# Altium schematic sheet OV2640硬件连接.SchDoc
size A4
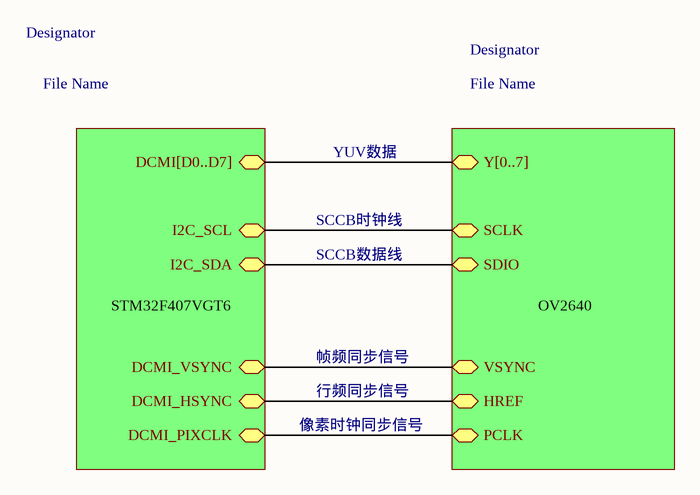
[diagram p0: OV2640硬件连接.SchDoc]

## Sub-sheets
Designator = File Name: DCMI[D0..D7], I2C_SCL, I2C_SDA, DCMI_VSYNC, DCMI_HSYNC, DCMI_PIXCLK
Designator = File Name: Y[0..7], SCLK, SDIO, VSYNC, HREF, PCLK

## Notes on the sheet
- SCCB时钟线
- YUV数据
- STM32F407VGT6
- SCCB数据线
- OV2640
- 帧频同步信号
- 行频同步信号
- 像素时钟同步信号